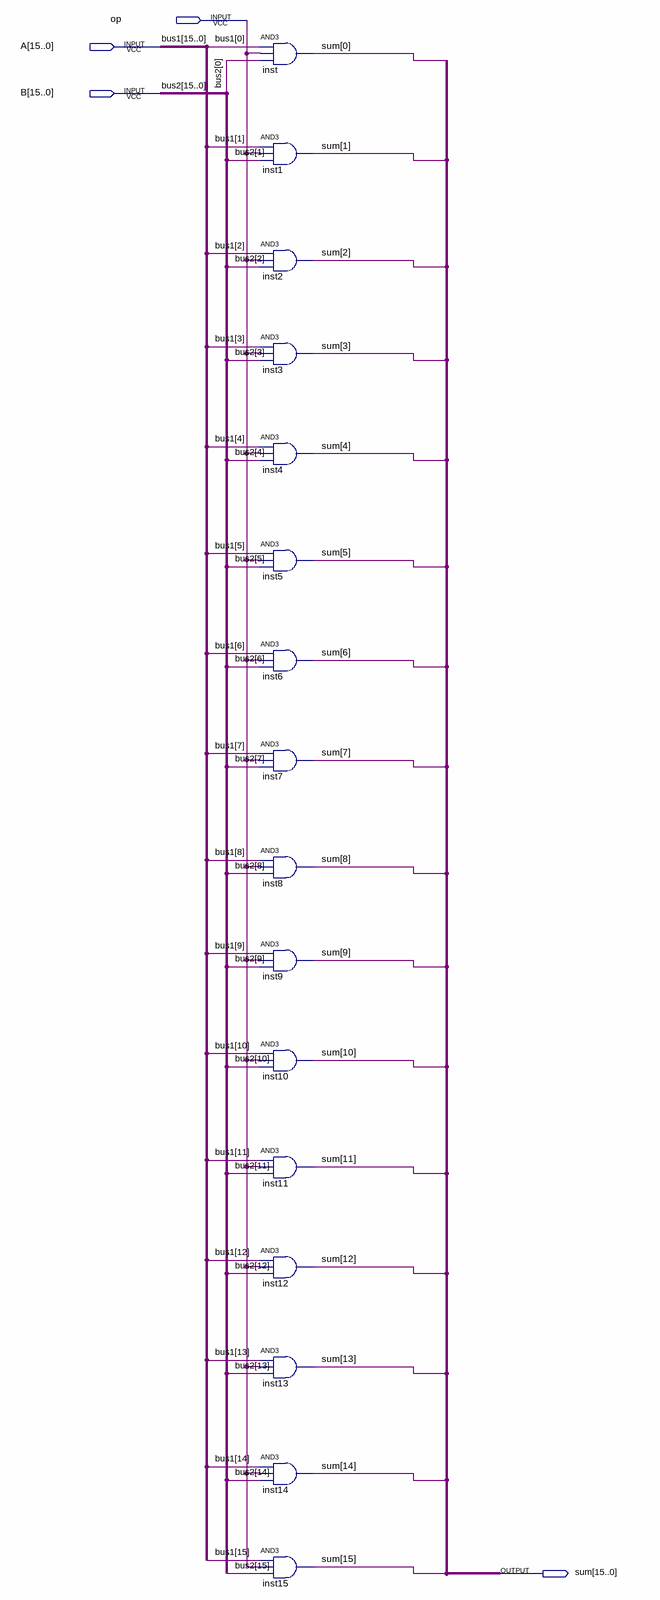
[diagram p0: schematic sheet]
// Quartus schematic ander16bit.bdf as structural Verilog: 16 symbols, 4 pins
module ander16bit (
  input  op,
  input  [15:0] A,
  input  [15:0] B,
  output [15:0] sum
);

  and inst (sum[0], A[0], op, B[0]);
  and inst1 (sum[1], A[1], op, B[1]);
  and inst2 (sum[2], A[2], op, B[2]);
  and inst3 (sum[3], A[3], op, B[3]);
  and inst4 (sum[4], A[4], op, B[4]);
  and inst5 (sum[5], A[5], op, B[5]);
  and inst6 (sum[6], A[6], op, B[6]);
  and inst7 (sum[7], A[7], op, B[7]);
  and inst8 (sum[8], A[8], op, B[8]);
  and inst9 (sum[9], A[9], op, B[9]);
  and inst10 (sum[10], A[10], op, B[10]);
  and inst11 (sum[11], A[11], op, B[11]);
  and inst12 (sum[12], A[12], op, B[12]);
  and inst13 (sum[13], A[13], op, B[13]);
  and inst14 (sum[14], A[14], op, B[14]);
  and inst15 (sum[15], A[15], op, B[15]);

  // Other names for the same wires on the sheet: bus1[15:0] = A; bus2[15:0] = B
endmodule
